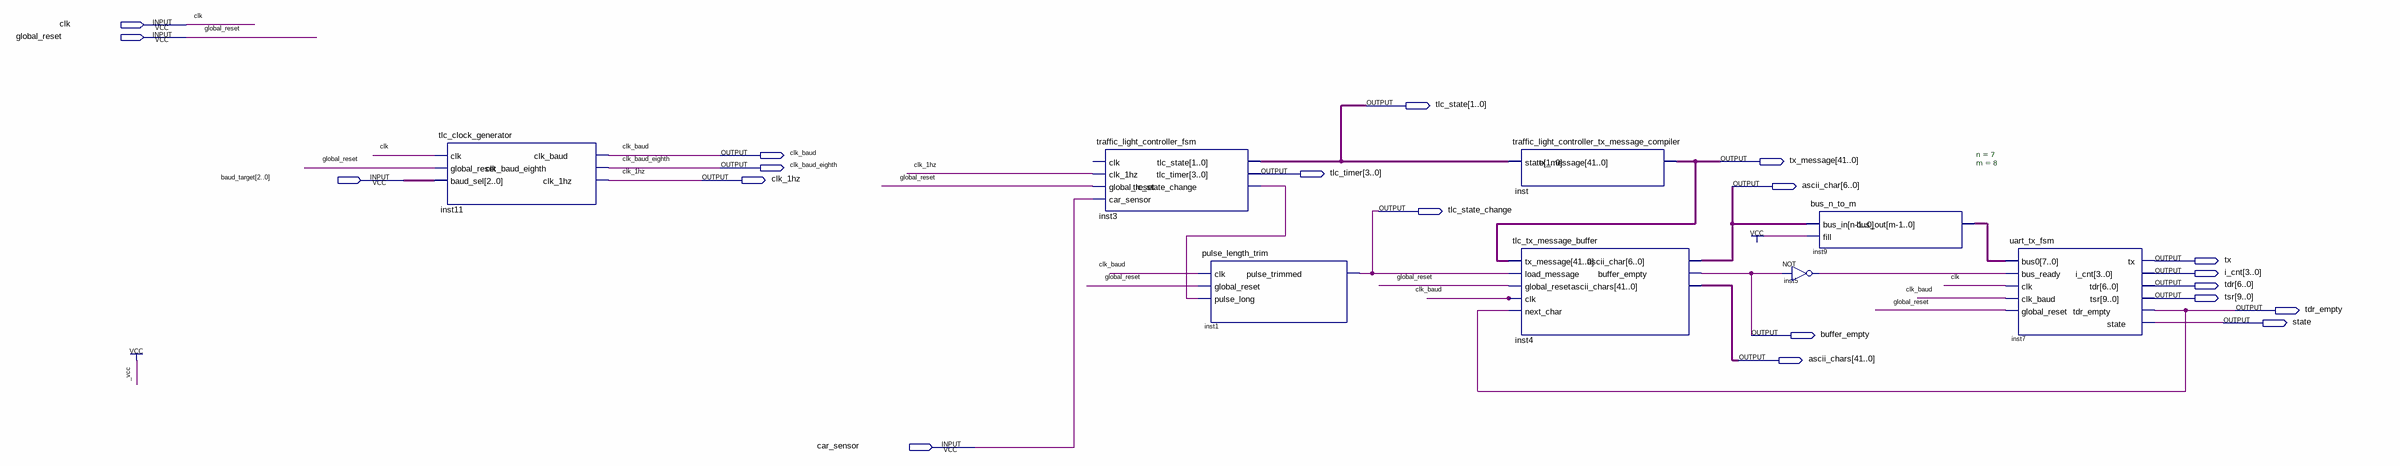
[diagram p0: schematic sheet]
// Quartus schematic generalTest.bdf as structural Verilog: 8 symbols, 20 pins
module generalTest (
  input  clk,
  input  global_reset,
  input  [2:0] baud_target,
  input  car_sensor,
  output [1:0] tlc_state,
  output clk_baud,
  output [41:0] tx_message,
  output clk_baud_eighth,
  output [3:0] tlc_timer,
  output clk_1hz,
  output [6:0] ascii_char,
  output tlc_state_change,
  output tx,
  output [3:0] i_cnt,
  output [6:0] tdr,
  output [9:0] tsr,
  output tdr_empty,
  output state,
  output buffer_empty,
  output [41:0] ascii_chars
);

  wire inst3_tlc_state_change, inst5_out;
  wire [7:0] inst9_bus_out;

  tlc_clock_generator inst11 (
    .clk(clk), .global_reset(global_reset), .baud_sel(baud_target), .clk_baud(clk_baud),
    .clk_baud_eighth(clk_baud_eighth), .clk_1hz(clk_1hz));
  traffic_light_controller_fsm inst3 (
    .clk_1hz(clk_1hz), .global_reset(global_reset), .car_sensor(car_sensor), .tlc_state(tlc_state),
    .tlc_timer(tlc_timer), .tlc_state_change(inst3_tlc_state_change));  // open: clk
  pulse_length_trim inst1 (
    .clk(clk_baud), .global_reset(global_reset), .pulse_long(inst3_tlc_state_change),
    .pulse_trimmed(tlc_state_change));
  traffic_light_controller_tx_message_compiler inst (.state(tlc_state), .tx_message(tx_message));
  tlc_tx_message_buffer inst4 (
    .tx_message(tx_message), .load_message(tlc_state_change), .global_reset(global_reset), .clk(clk_baud),
    .next_char(tdr_empty), .ascii_char(ascii_char), .buffer_empty(buffer_empty), .ascii_chars(ascii_chars));
  bus_n_to_m #(.n(7), .m(8)) inst9 (.bus_in(ascii_char), .fill(1'b1), .bus_out(inst9_bus_out));
  not inst5 (inst5_out, buffer_empty);
  uart_tx_fsm inst7 (
    .bus0(inst9_bus_out), .bus_ready(inst5_out), .clk(clk), .clk_baud(clk_baud), .global_reset(global_reset),
    .tx(tx), .i_cnt(i_cnt), .tdr(tdr), .tsr(tsr), .tdr_empty(tdr_empty), .state(state));
endmodule
